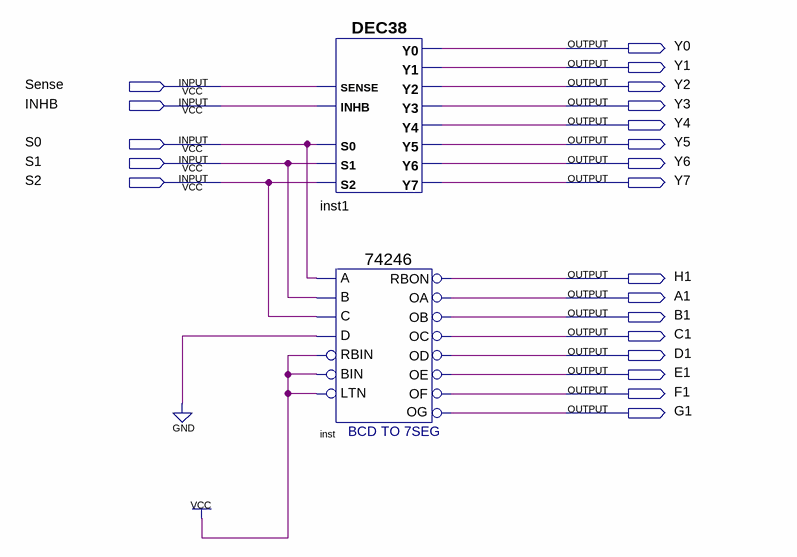
[diagram p0: schematic sheet]
// Quartus schematic cmb.bdf as structural Verilog: 2 symbols, 21 pins
module cmb (
  input  Sense,
  input  INHB,
  input  S0,
  input  S1,
  input  S2,
  output Y0,
  output Y1,
  output Y2,
  output Y3,
  output Y4,
  output Y5,
  output Y6,
  output Y7,
  output H1,
  output A1,
  output B1,
  output C1,
  output D1,
  output E1,
  output F1,
  output G1
);

  DEC38 inst1 (
    .S2(S2), .S1(S1), .INHB(INHB), .S0(S0), .SENSE(Sense), .Y7(Y7), .Y6(Y6), .Y5(Y5), .Y3(Y3), .Y4(Y4),
    .Y0(Y0), .Y1(Y1), .Y2(Y2));
  \74246  inst (
    .B(S1), .A(S0), .RBIN(1'b1), .D(1'b0), .C(S2), .LTN(1'b1), .BIN(1'b1), .OD(D1), .RBON(H1), .OC(C1),
    .OB(B1), .OE(E1), .OF(F1), .OA(A1), .OG(G1));
endmodule
